# EAGLE design rgb-micromatch (EAGLE 4.16)
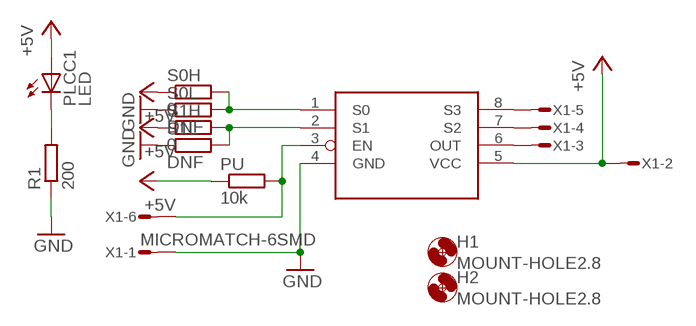
[diagram p0: schematic, sheet 1]

## Parts
H1  MOUNT-HOLE2.8  [2,8]
H2  MOUNT-HOLE2.8  [2,8]
PLCC1  LED  [P-LCC-2]
PU  10k  R-EU_R0603  [R0603]
R1  200  R-EU_R0603  [R0603]
S0H  0  R-EU_R0603  [R0603]
S0L  DNF  R-EU_R0603  [R0603]
S1H  0  R-EU_R0603  [R0603]
S1L  DNF  R-EU_R0603  [R0603]
U$1  TCS230  [SOIC8]
X1  MICROMATCH-6SMD  [MICROMATCH-6-SMD]

## Nets
+5V: PLCC1.A PU.1 S0H.1 S1H.1 U$1.5(VCC) X1.2
GND: R1.1 S0L.1 S1L.1 U$1.4(GND) X1.1
N$1: PLCC1.C R1.2
N$2: S1H.2 S1L.2 U$1.2(S1)
N$3: S0H.2 S0L.2 U$1.1(S0)
N$4: U$1.6(OUT) X1.3
N$5: U$1.7(S2) X1.4
N$6: U$1.8(S3) X1.5
N$7: PU.2 U$1.3(EN) X1.6

## Library data of the parts
H1 H2 = holes:MOUNT-HOLE: MOUNTING HOLE with drill center marker
PLCC1 = robot:LED
PU R1 S0H S0L S1H S1L = rcl:R-EU_: RESISTOR, European symbol
U$1 = tcs230:TCS230
X1 = robot_con-amp-micromatch:MICROMATCH-6: MicroMaTch 6 7-215464-6 / 0-215464-6 Drawing Number C-215464 DDEController.pdf

## Board
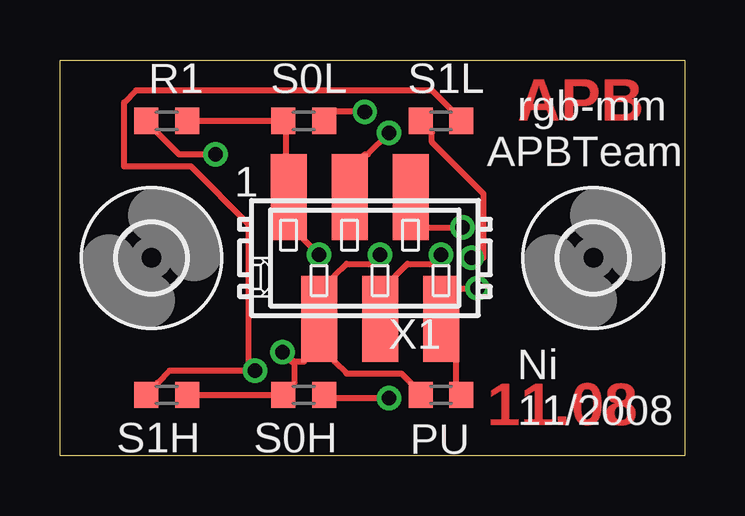
[diagram p1: board, top side]
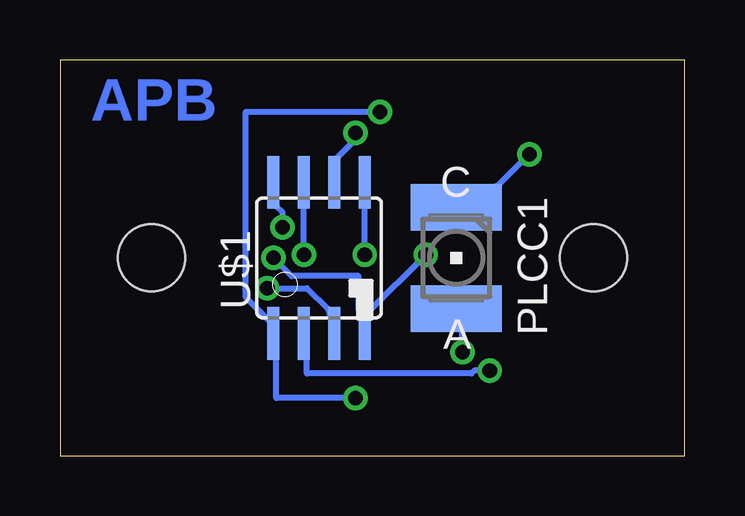
[diagram p2: board, bottom side, seen from below]

Size 26.04 x 16.51 mm. Coordinates in mm from the lower left corner, seen from the top.
Outline: 0,0 0,16.51 26.04,16.51 26.04,0 0,0
Copper layers (1*16): Top 0.035mm / dielectric 1.5mm / Bottom 0.035mm
Design rules "olimex": minimum track width 10mil, minimum drill 24mil, track to track 10mil, track to pad 10mil, pad to pad 10mil, via to via 10mil, smd to smd 10mil, copper to edge 40mil, drill to drill 10mil, minimum pad ring 10mil, minimum via ring 8mil, stop-mask expansion 0mil, vias tented up to drill 0mil, thermal gap 10mil

### Footprints (pad centres in the part's own frame; a part is rotated, then mirrored left to right if it is on the bottom)
2,8 = hole 2.8: 0,0
P-LCC-2 = smd 3.81 x 1.93: A 0,2.75; C 0,-1.48
R0603 = smd 1 x 1.1: 1 -0.85,0; 2 0.85,0
SOIC8 = smd 0.5 x 2.2: 1 -1.905,-3.154; 2 -0.645,-3.154; 3 0.625,-3.154; 4 1.895,-3.154; 5 1.905,3.154; 6 0.635,3.154; 7 -0.635,3.154; 8 -1.905,3.154
MICROMATCH-6-SMD = smd 1.5 x 3.58: 1 3.175,-2.54; 2 1.905,2.54; 3 0.635,-2.54; 4 -0.635,2.54; 5 -1.905,-2.54; 6 -3.175,2.54

### Placement (x,y rotation side)
H1  3.81,8.26 0 top
H2  22.23,8.26 0 top
PLCC1  9.53,8.89 180 bottom
PU  15.88,2.54 0 top
R1  4.45,13.97 180 top
S0H  10.16,2.54 0 top
S0L  10.16,13.97 0 top
S1H  4.45,2.54 180 top
S1L  15.88,13.97 0 top
U$1  15.24,8.26 0 bottom
X1  12.7,8.26 180 top

### Tracks (layer width: path | path; a pad name or v marks a point on that pad's centre or on a via)
+5V  (via drill 0.61)
  Top 0.254: S1H.1 S0H.1 9.78,3.05 9.78,3.94 | PU.1 14.61,3.05 14.22,3.43 11.94,3.43 11.43,3.94 X1.2 | v13.34,8.38 12.95,8 11.94,8 11.43,7.49 X1.2 | 9.78,3.94 10.16,3.94 X1.2 | v9.27,4.32 9.65,3.94 9.78,3.94
  Bottom 0.254: v13.34,8.38 U$1.5 | v9.27,4.32 9.27,5.21 PLCC1.A
GND  (via drill 0.61)
  Top 0.254: R1.1 S0L.1 9.4,13.46 9.4,12.57 X1.1 10.16,9.02 v10.79,8.38 | v17.14,8.26 17.65,8.26 17.65,10.92 15.49,13.08 15.49,13.46 S1L.1
  Bottom 0.254: v17.14,8.26 16.38,7.49 13.59,7.49 13.59,6.1 U$1.4 13.21,5.97 v10.79,8.38
N$1  (via drill 0.61)
  Top 0.254: v6.48,12.57 4.95,12.57 4.06,13.46 R1.2
  Bottom 0.254: v6.48,12.57 7.75,11.3 PLCC1.C
N$2  (via drill 0.61)
  Top 0.254: S1H.2 4.06,3.05 4.57,3.56 v8.13,3.56 7.87,3.94 7.87,9.65 5.46,12.06 2.67,12.06 2.67,14.73 3.17,15.24 15.49,15.24 16.26,14.48 S1L.2
  Bottom 0.254: v8.13,3.56 8.76,3.56 8.89,3.43 15.75,3.43 15.75,4.06 U$1.2
N$3  (via drill 0.61)
  Top 0.254: v13.72,2.41 11.43,2.41 S0H.2 | v12.7,14.35 11.43,14.35 S0L.2
  Bottom 0.254: v13.72,2.41 17.02,2.41 17.02,4.06 U$1.1 17.27,5.59 18.29,6.6 18.29,14.35 v12.7,14.35
N$4  (via drill 0.61)
  Top 0.254: v13.72,13.46 12.83,12.57 12.7,12.57 X1.3
  Bottom 0.254: v13.72,13.46 13.72,13.21 14.48,12.45 U$1.6
N$5  (via drill 0.61)
  Top 0.254: v15.88,8.38 15.49,8 14.48,8 13.97,7.49 X1.4
  Bottom 0.254: v15.88,8.38 U$1.7
N$6  (via drill 0.61)
  Top 0.254: v16.76,9.53 15.24,9.53 X1.5
  Bottom 0.254: v16.76,9.53 16.76,10.16 17.02,10.41 U$1.8
N$7  (via drill 0.61)
  Top 0.254: PU.2 16.51,3.05 16.51,3.94 X1.6 16.51,6.99 v17.4,6.99
  Bottom 0.254: v17.4,6.99 15.75,6.99 14.86,6.1 U$1.3

### Text on the board
Top: APB | 11.08
Bottom: APB
tNames: rgb-mm | APBTeam | Ni | 11/2008